# EAGLE design ledecorator-core-board (EAGLE 9.4.2)
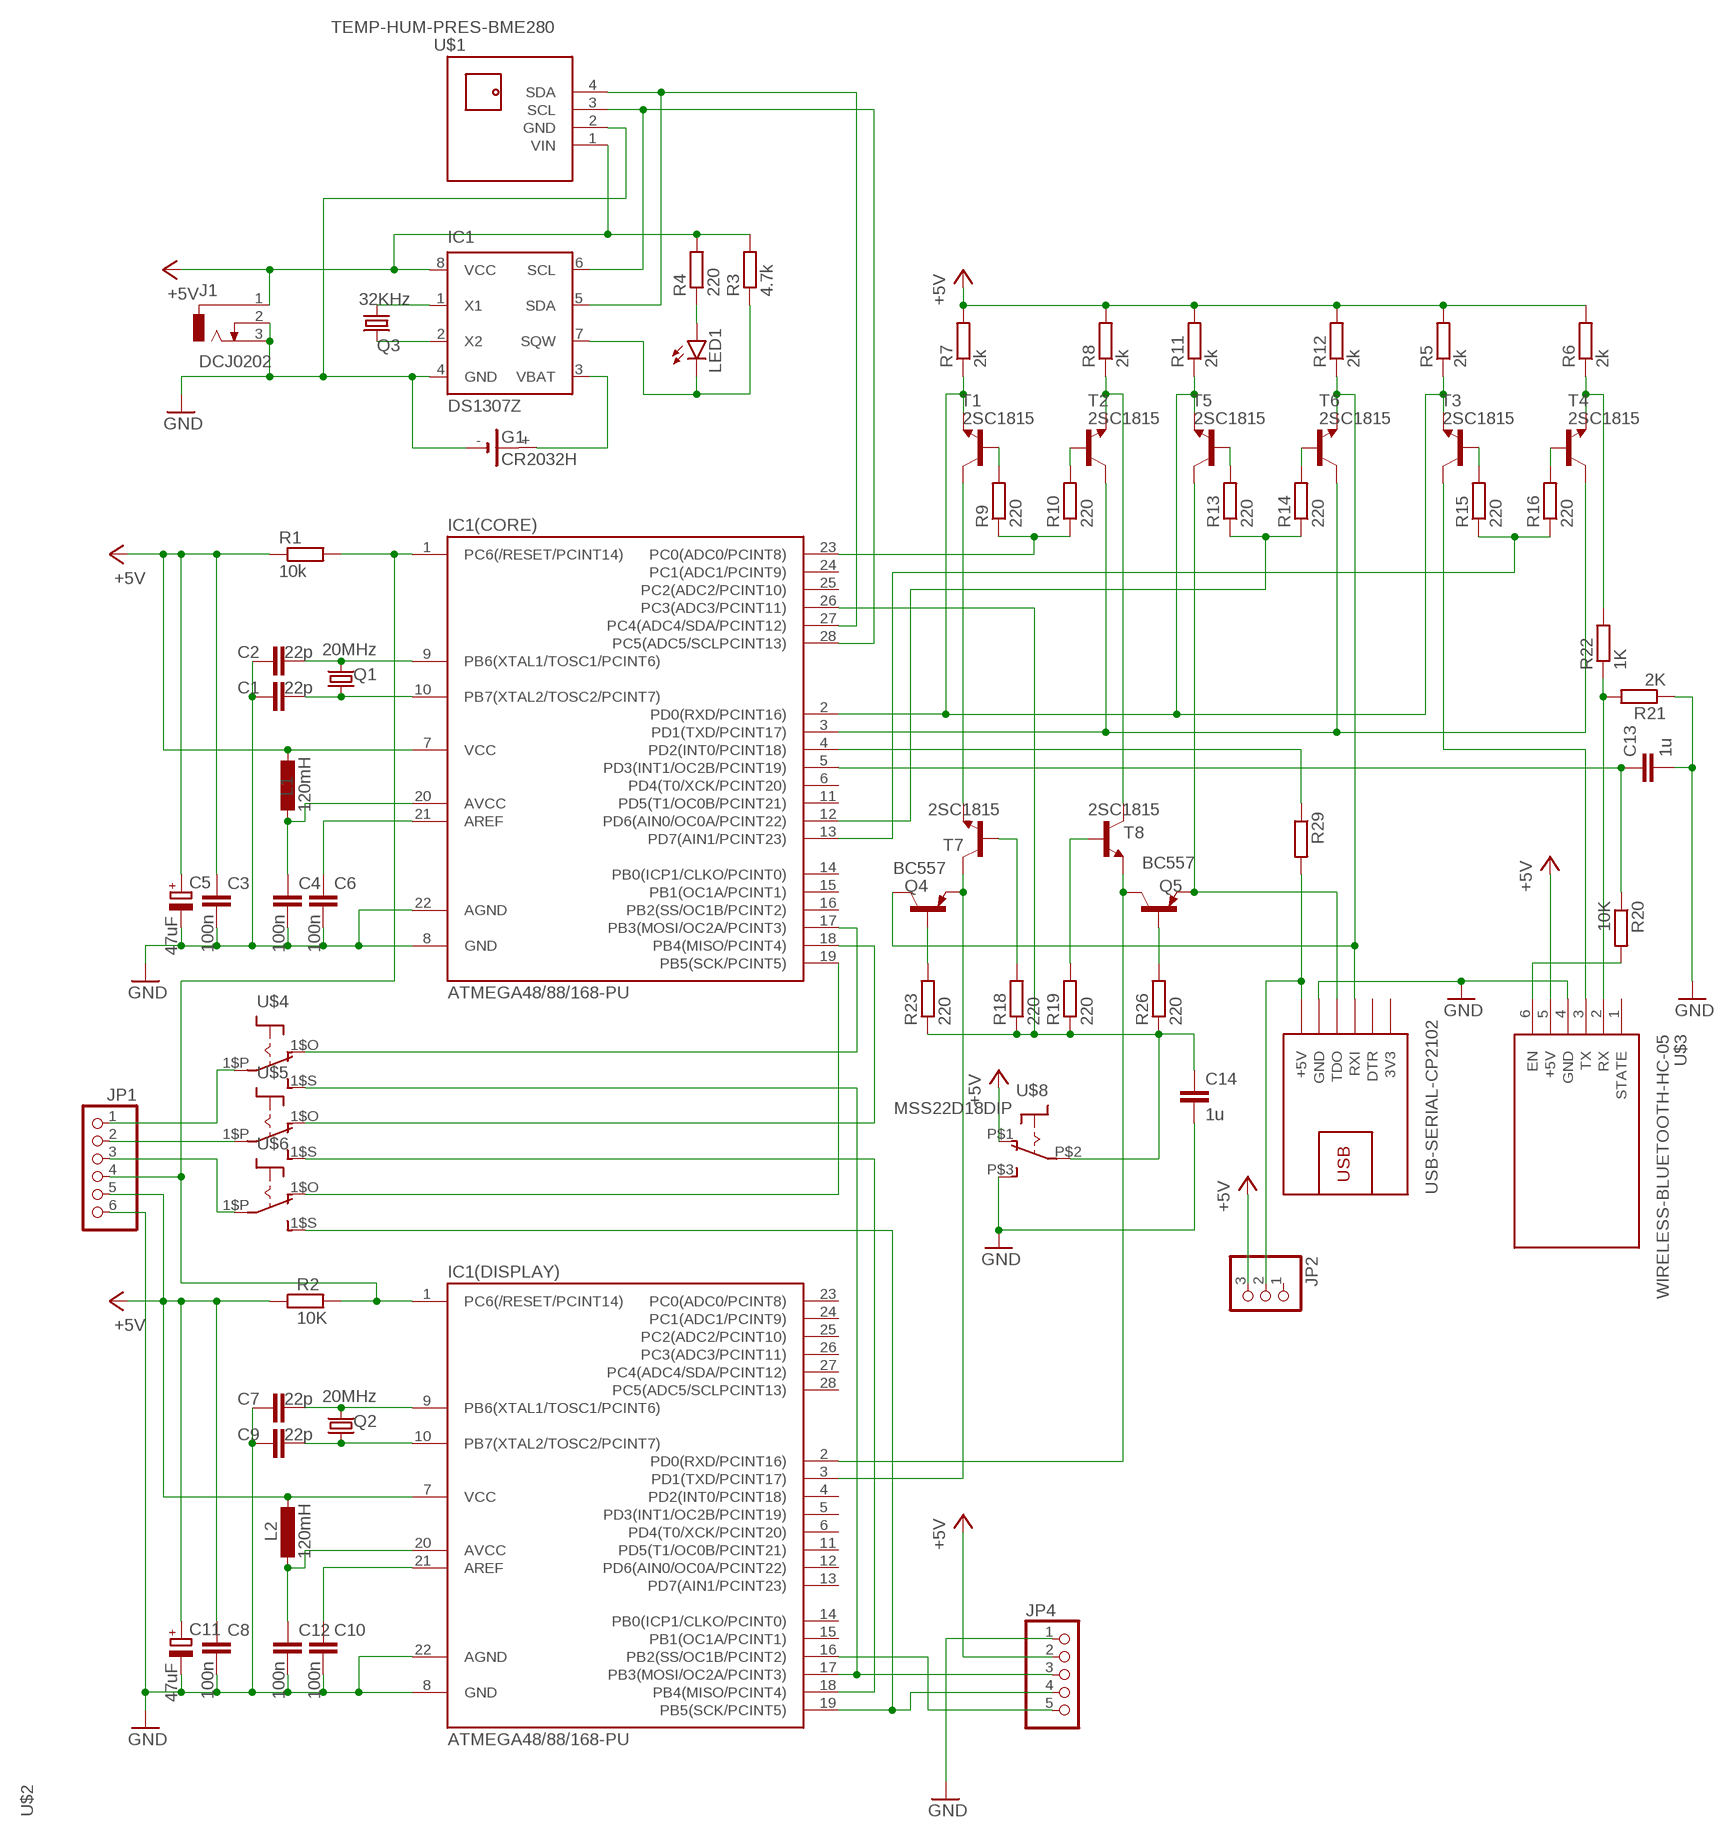
[diagram p0: schematic, sheet 1]

## Parts
C1  22p  C-EU025-025X050  [C025-025X050]
C2  22p  C-EU025-025X050  [C025-025X050]
C3  100n  C-EU025-025X050  [C025-025X050]
C4  100n  C-EUC1206  [C1206]
C5  47uF  CPOL-EUE2-4  [E2-4]
C6  100n  C-EUC1206  [C1206]
C7  22p  C-EU025-025X050  [C025-025X050]
C8  100n  C-EU025-025X050  [C025-025X050]
C9  22p  C-EU025-025X050  [C025-025X050]
C10  100n  C-EU025-025X050  [C025-025X050]
C11  47uF  CPOL-EUE2-4  [E2-4]
C12  100n  C-EU025-025X050  [C025-025X050]
C13  1u  C-EUC1206  [C1206]
C14  1u  C-EU050-025X075  [C050-025X075]
G1  CR2032H  [CR2032H]
IC1  DS1307Z  [SOIC8]
IC1(CORE)  ATMEGA48/88/168-PU  [DIL28-3]
IC1(DISPLAY)  ATMEGA48/88/168-PU  [DIL28-3]
J1  DCJ0202  [DCJ0202]
JP1  PINHD-1X6/90  [1X06/90]
JP2  PINHD-1X3/90  [1X03/90]
JP4  PINHD-1X5  [1X05]
L1  120mH  L-EU0207/10  [0207/10]
L2  120mH  L-EU0207/10  [0207/10]
LED1  LED3MM  [LED3MM]
Q1  20MHz  CRYSTALHC49S  [HC49/S]
Q2  20MHz  CRYSTALHC49S  [HC49/S]
Q3  32KHz  CRYSTALTC26H  [TC26H]
Q4  BC557  [TO92-EBC]
Q5  BC557  [TO92-EBC]
R1  10k  R-EU_0207/10  [0207/10]
R2  10K  R-EU_0207/10  [0207/10]
R3  4.7k  R-EU_R1206  [R1206]
R4  220  R-EU_R1206  [R1206]
R5  2k  R-EU_0207/12  [0207/12]
R6  2k  R-EU_0207/12  [0207/12]
R7  2k  R-EU_R1206  [R1206]
R8  2k  R-EU_R1206  [R1206]
R9  220  R-EU_0207/10  [0207/10]
R10  220  R-EU_0207/10  [0207/10]
R11  2k  R-EU_0207/12  [0207/12]
R12  2k  R-EU_0207/10  [0207/10]
R13  220  R-EU_0207/10  [0207/10]
R14  220  R-EU_0207/10  [0207/10]
R15  220  R-EU_0207/10  [0207/10]
R16  220  R-EU_0207/10  [0207/10]
R18  220  R-EU_0207/10  [0207/10]
R19  220  R-EU_0207/10  [0207/10]
R20  10K  R-EU_0207/10  [0207/10]
R21  2K  R-EU_0207/10  [0207/10]
R22  1K  R-EU_0207/10  [0207/10]
R23  220  R-EU_R1206  [R1206]
R26  220  R-EU_R1206  [R1206]
R29  R-EU_0207/10  [0207/10]
T1  2SC1815  [TO92-ECB]
T2  2SC1815  [TO92-ECB]
T3  2SC1815  [TO92-ECB]
T4  2SC1815  [TO92-ECB]
T5  2SC1815  [TO92-ECB]
T6  2SC1815  [TO92-ECB]
T7  2SC1815  [TO92-ECB]
T8  2SC1815  [TO92-ECB]
U$1  TEMP-HUM-PRES-BME280  [TEMP-HUM-PRES-BME280]
U$2  USB-SERIAL-CP2102  [USB-SERIAL-CP2102]
U$3  WIRELESS-BLUETOOTH-HC-05  [WIRELESS-BLUETOOTH-HC-05]
U$4  SS12D00DIP  [SS12D00]
U$5  SS12D00DIP  [SS12D00]
U$6  SS12D00DIP  [SS12D00]
U$8  MSS22D18DIP  [MSS22D18]

## Nets
+5V: C3.1 C5.+ C8.1 C11.+ IC1(CORE).7(VCC) IC1(DISPLAY).7(VCC) IC1.8(VCC) J1.1 JP1.5 JP2.3 JP4.2 L1.1 L2.1 R1.1 R2.1 R3.2 R4.2 R5.2 R6.2 R7.2 R8.2 R11.2 R12.2 U$1.1(VIN) U$3.5(+5V) U$8.P$1(O)
BLE$CTRL: IC1(CORE).13(PD7(AIN1/PCINT23)) R15.1 R16.1
BLE$RX: R21.2 R22.1 U$3.2(RX)
BLE$TX: T3.C U$3.3(TX)
BLR$STATE$1: C13.1 IC1(CORE).5(PD3(INT1/OC2B/PCINT19)) R20.1
DISPLAY$RX: IC1(DISPLAY).2(PD0(RXD/PCINT16)) Q5.C T8.E
DISPLAY$SRC: C14.1 IC1(CORE).26(PC3(ADC3/PCINT11)) R18.1 R19.1 R23.1 R26.1 U$8.P$2(P)
DISPLAY$TX: IC1(DISPLAY).3(PD1(TXD/PCINT17)) Q4.E T7.C
GND: C1.1 C2.1 C3.2 C4.2 C5.- C6.2 C7.1 C8.2 C9.1 C10.2 C11.- C12.2 C13.2 C14.2 G1.- IC1(CORE).8(GND) IC1(CORE).22(AGND) IC1(DISPLAY).8(GND) IC1(DISPLAY).22(AGND) IC1.4(GND) J1.2 J1.3 JP1.6 JP4.1 R21.1 U$1.2(GND) U$2.5(GND) U$3.4(GND) U$8.P$3(S)
MISO: JP1.2 U$5.1$P(P)
MOSI: JP1.1 U$4.1$P(P)
N$1: C6.1 IC1(CORE).21(AREF)
N$2: Q4.B R23.2
N$3: C2.2 IC1(CORE).9(PB6(XTAL1/TOSC1/PCINT6)) Q1.2
N$4: C1.2 IC1(CORE).10(PB7(XTAL2/TOSC2/PCINT7)) Q1.1
N$5: IC1.2(X2) Q3.2
N$6: C4.1 IC1(CORE).20(AVCC) L1.2
N$7: C7.2 IC1(DISPLAY).9(PB6(XTAL1/TOSC1/PCINT6)) Q2.2
N$8: C9.2 IC1(DISPLAY).10(PB7(XTAL2/TOSC2/PCINT7)) Q2.1
N$9: C10.1 IC1(DISPLAY).21(AREF)
N$10: C12.1 IC1(DISPLAY).20(AVCC) L2.2
N$11: LED1.A R4.1
N$12: G1.+ IC1.3(VBAT)
N$13: IC1.1(X1) Q3.1
N$14: IC1.7(SQW) LED1.K(C) R3.1
N$16: R10.2 T2.B
N$17: R9.2 T1.B
N$18: IC1(CORE).23(PC0(ADC0/PCINT8)) R9.1 R10.1
N$19: R15.2 T3.B
N$20: R16.2 T4.B
N$21: R20.2 U$3.6(EN)
N$22: R13.2 T5.B
N$23: R14.2 T6.B
N$25: R18.2 T7.B
N$26: R19.2 T8.B
N$28: R6.1 R22.2 T4.E
N$29: IC1(DISPLAY).16(PB2(SS/OC1B/PCINT2)) JP4.5
N$30: T1.C T7.E
N$37: R8.1 T2.E T8.C
N$42: IC1(CORE).18(PB4(MISO/PCINT4)) U$5.1$O(O)
N$43: IC1(CORE).17(PB3(MOSI/OC2A/PCINT3)) U$4.1$O(O)
N$45: Q5.B R26.2
N$49: JP2.2 R29.2 U$2.6(+5V)
N$50: IC1(DISPLAY).18(PB4(MISO/PCINT4)) U$5.1$S(S)
N$51: IC1(DISPLAY).17(PB3(MOSI/OC2A/PCINT3)) JP4.3 U$4.1$S(S)
RESET: IC1(CORE).1(PC6(/RESET/PCINT14)) IC1(DISPLAY).1(PC6(/RESET/PCINT14)) JP1.4 R1.2 R2.2
RX: IC1(CORE).2(PD0(RXD/PCINT16)) R5.1 R7.1 R11.1 T1.E T3.E T5.E
SCK: JP1.3 U$6.1$P(P)
SCK$CORE: IC1(CORE).19(PB5(SCK/PCINT5)) U$6.1$O(O)
SCK$DISPLAY: IC1(DISPLAY).19(PB5(SCK/PCINT5)) JP4.4 U$6.1$S(S)
SCL: IC1(CORE).28(PC5(ADC5/SCLPCINT13)) IC1.6(SCL) U$1.3(SCL)
SDA: IC1(CORE).27(PC4(ADC4/SDA/PCINT12)) IC1.5(SDA) U$1.4(SDA)
TX: IC1(CORE).3(PD1(TXD/PCINT17)) T2.C T4.C T6.C
USB$CTRL: IC1(CORE).12(PD6(AIN0/OC0A/PCINT22)) R13.1 R14.1
USB$RX: Q4.C R12.1 T6.E U$2.3(RXI)
USB$STATE: IC1(CORE).4(PD2(INT0/PCINT18)) R29.1
USB$TX: Q5.E T5.C U$2.4(TDO)
Unconnected: IC1(CORE).6(PD4(T0/XCK/PCINT20)) IC1(CORE).11(PD5(T1/OC0B/PCINT21)) IC1(CORE).14(PB0(ICP1/CLKO/PCINT0)) IC1(CORE).15(PB1(OC1A/PCINT1)) IC1(CORE).16(PB2(SS/OC1B/PCINT2)) IC1(CORE).24(PC1(ADC1/PCINT9)) IC1(CORE).25(PC2(ADC2/PCINT10)) IC1(DISPLAY).4(PD2(INT0/PCINT18)) IC1(DISPLAY).5(PD3(INT1/OC2B/PCINT19)) IC1(DISPLAY).6(PD4(T0/XCK/PCINT20)) IC1(DISPLAY).11(PD5(T1/OC0B/PCINT21)) IC1(DISPLAY).12(PD6(AIN0/OC0A/PCINT22)) IC1(DISPLAY).13(PD7(AIN1/PCINT23)) IC1(DISPLAY).14(PB0(ICP1/CLKO/PCINT0)) IC1(DISPLAY).15(PB1(OC1A/PCINT1)) IC1(DISPLAY).23(PC0(ADC0/PCINT8)) IC1(DISPLAY).24(PC1(ADC1/PCINT9)) IC1(DISPLAY).25(PC2(ADC2/PCINT10)) IC1(DISPLAY).26(PC3(ADC3/PCINT11)) IC1(DISPLAY).27(PC4(ADC4/SDA/PCINT12)) IC1(DISPLAY).28(PC5(ADC5/SCLPCINT13)) JP2.1 U$2.2(DTR) U$3.1(STATE)

## Power pins joined to a net without a drawn wire
3V3: U$2.1(3V3)

## Library data of the parts
C1-C4 C6-C10 C12-C14 = rcl:C-EU: CAPACITOR, European symbol; SPICEPREFIX: C
C5 C11 = rcl:CPOL-EU: POLARIZED CAPACITOR, European symbol; SPICEPREFIX: C
G1 = battery_cr2032:CR2032H: LI BATTERY Varta
IC1 = ds1307_pcf8583:DS1307: I2C-Bus CLOCK/CALENDAR
IC1(CORE) IC1(DISPLAY) = atmega8:ATMEGA48/88/168-PU
J1 = con-jack:DCJ0202: DC POWER JACK Source: DCJ0202.pdf; OC_FARNELL: unknown; OC_NEWARK: unknown
JP1 = pinhead:PINHD-1X6: PIN HEADER
JP2 = pinhead:PINHD-1X3: PIN HEADER
JP4 = pinhead:PINHD-1X5: PIN HEADER
L1 L2 = rcl:L-EU: INDUCTOR, European symbol; SPICEPREFIX: L
LED1 = led:LED: LED OSRAM: - CHIPLED LG R971, LG N971, LY N971, LG Q971, LY Q971, LO R971, LY R971 LH N974, LH R974 LS Q976, LO Q976, LY Q976 LO Q996 - Hyper CHIPLED LW Q18S LB Q993, LB Q99A, LB R99A - SideLED LS A670, LO A670, LY A670, LG A670, LP A670 LB A673, LV A673, LT A673, LW A673 LH A674 LY A675 LS A676, LA A676, LO A676, LY A676, LW A676 LS A679, LY A679, LG A679 - Hyper Micro SIDELED® LS Y876, LA Y876, LO Y876, LY Y876 LT Y87S - SmartLED LW L88C, LW L88S LB L89C, LB L89S, LG L890 LS L89K, LO L89K, LY L89K LS L896, LA L896, LO L896, LY L896 - TOPLED LS T670, LO T670, LY T670, LG T670, LP T670 LSG T670, LSP T670, LSY T670, LOP T670, LYG T670 LG T671, LOG T671, LSG T671 LB T673, LV T673, LT T673, LW T673 LH T674 LS T676, LA T676, LO T676, LY T676, LB T676, LH T676, LSB T676, LW T676 LB T67C, LV T67C, LT T67C, LS T67K, LO T67K, LY T67K, LW E67C LS E67B, LA E67B, LO E67B, LY E67B, LB E67C, LV E67C, LT E67C LW T67C LS T679, LY T679, LG T679 LS T770, LO T770, LY T770, LG T770, LP T770 LB T773, LV T773, LT T773, LW T773 LH T774 LS E675, LA E675, LY E675, LS T675 LS T776, LA T776, LO T776, LY T776, LB T776 LHGB T686 LT T68C, LB T68C - Hyper Mini TOPLED® LB M676 - Mini TOPLED Santana® LG M470 LS M47K, LO M47K, LY M47K Source: http://www.osram.convergy.de LUXEON: - LUMILED® LXK2-PW12-R00, LXK2-PW12-S00, LXK2-PW14-U00, LXK2-PW14-V00 LXK2-PM12-R00, LXK2-PM12-S00, LXK2-PM14-U00 LXK2-PE12-Q00, LXK2-PE12-R00, LXK2-PE12-S00, LXK2-PE14-T00, LXK2-PE14-U00 LXK2-PB12-K00, LXK2-PB12-L00, LXK2-PB12-M00, LXK2-PB14-N00, LXK2-PB14-P00, LXK2-PB14-Q00 LXK2-PR12-L00, LXK2-PR12-M00, LXK2-PR14-Q00, LXK2-PR14-R00 LXK2-PD12-Q00, LXK2-PD12-R00, LXK2-PD12-S00 LXK2-PH12-R00, LXK2-PH12-S00 LXK2-PL12-P00, LXK2-PL12-Q00, LXK2-PL12-R00 Source: www.luxeon.com KINGBRIGHT: KA-3528ASYC Source: www.kingbright.com
Q1 Q2 = crystal:CRYSTAL: CRYSTAL; OC_FARNELL: 1667008; OC_NEWARK: unknown
Q3 = crystal:CRYSTAL: CRYSTAL; OC_FARNELL: unknown; OC_NEWARK: unknown
Q4 Q5 = transistor-pnp:BC557*: PNP Transistror
R1-R16 R18-R23 R26 R29 = rcl:R-EU_: RESISTOR, European symbol; SPICEPREFIX: R
T1-T8 = transistor:2SC1815: NPN EPITAXIAL TRANSISTOR Source: TOSHIBA .. 2SC1815 1.pdf
U$1 = diy-modules:TEMP-HUM-PRES-BME280: Digital Humidity-Temperature-Pressure Sensor based on BME280 device More information about BME280 device is available here: https://www.bosch-sensortec.com/bst/products/all_products/bme280 Click here to find device on ebay.com <http://www.ebay.com/sch/bme280+breakout>
U$2 = diy-modules:USB-SERIAL-CP2102: USB to Serial UART Converter based on CP2102 chip More information about CP2102 chip is available here: https://www.silabs.com/documents/public/data-sheets/CP2102-9.pdf Drivers for CP210x devices are available here: http://www.silabs.com/products/development-tools/software/usb-to-uart-bridge-vcp-drivers Click here to find device on ebay.com <http://www.ebay.com/sch/cp2102+micro+usb>
U$3 = diy-modules:WIRELESS-BLUETOOTH-HC-05: Bluetooth Transceiver Module based on HC-05 board Tutorial is available here: https://arduino-info.wikispaces.com/BlueTooth-HC05-HC06-Modules-How-To Click here to find device on ebay.com <http://www.ebay.com/sch/hc-05+module+rs232>
U$4-U$6 = dragberry:SS12D00
U$8 = dragberry:MSS22D18

## Board
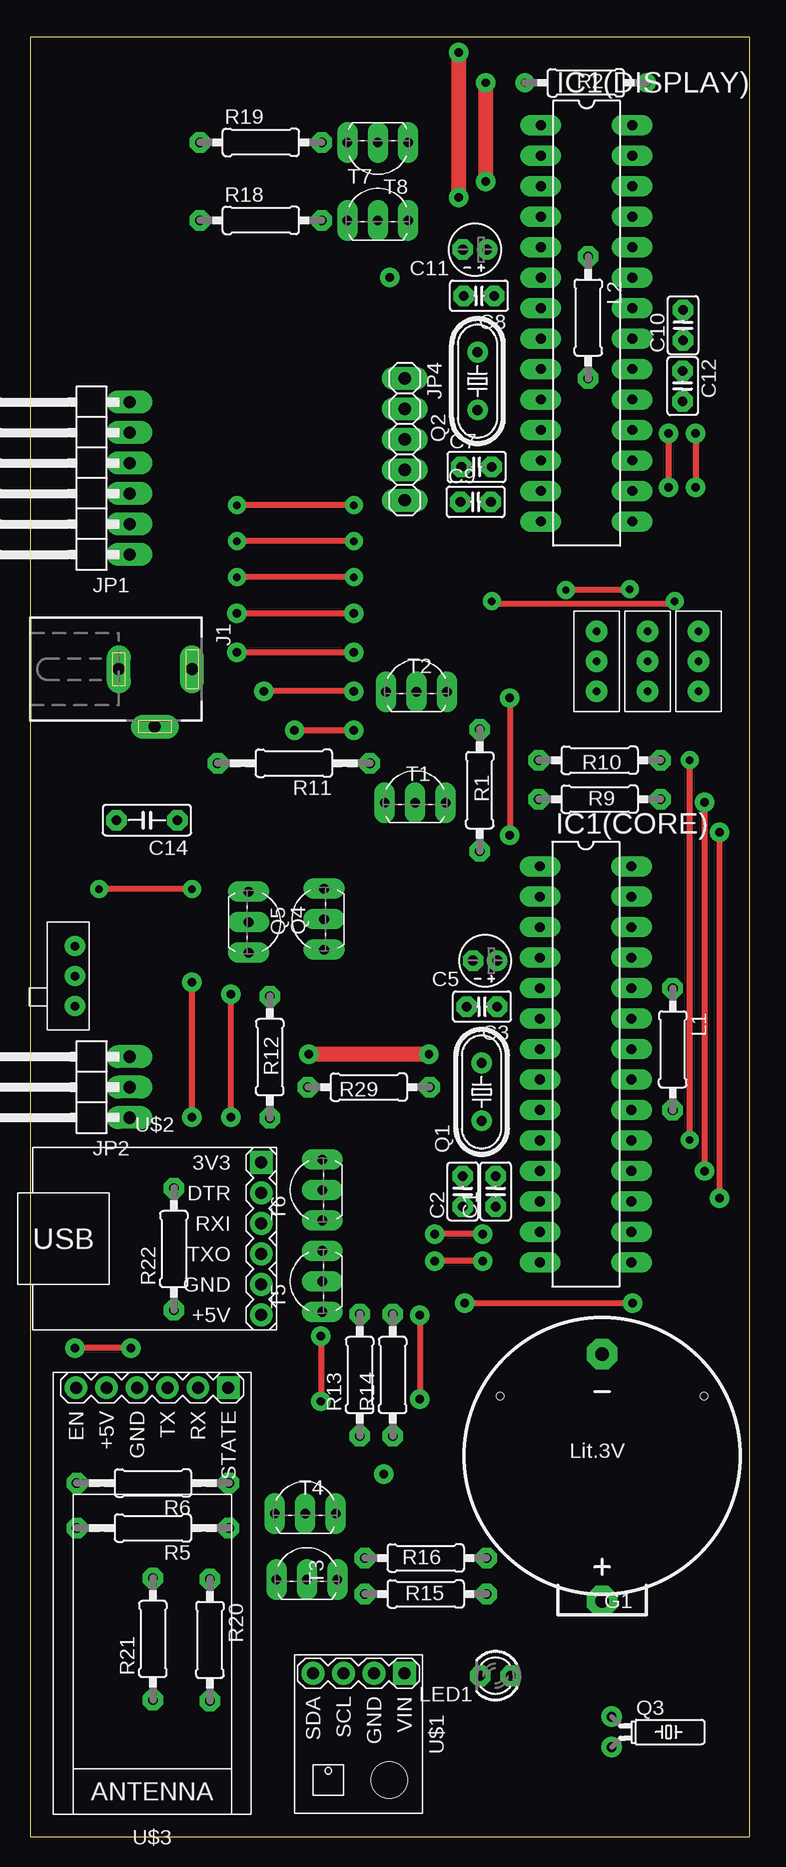
[diagram p1: board, top side]
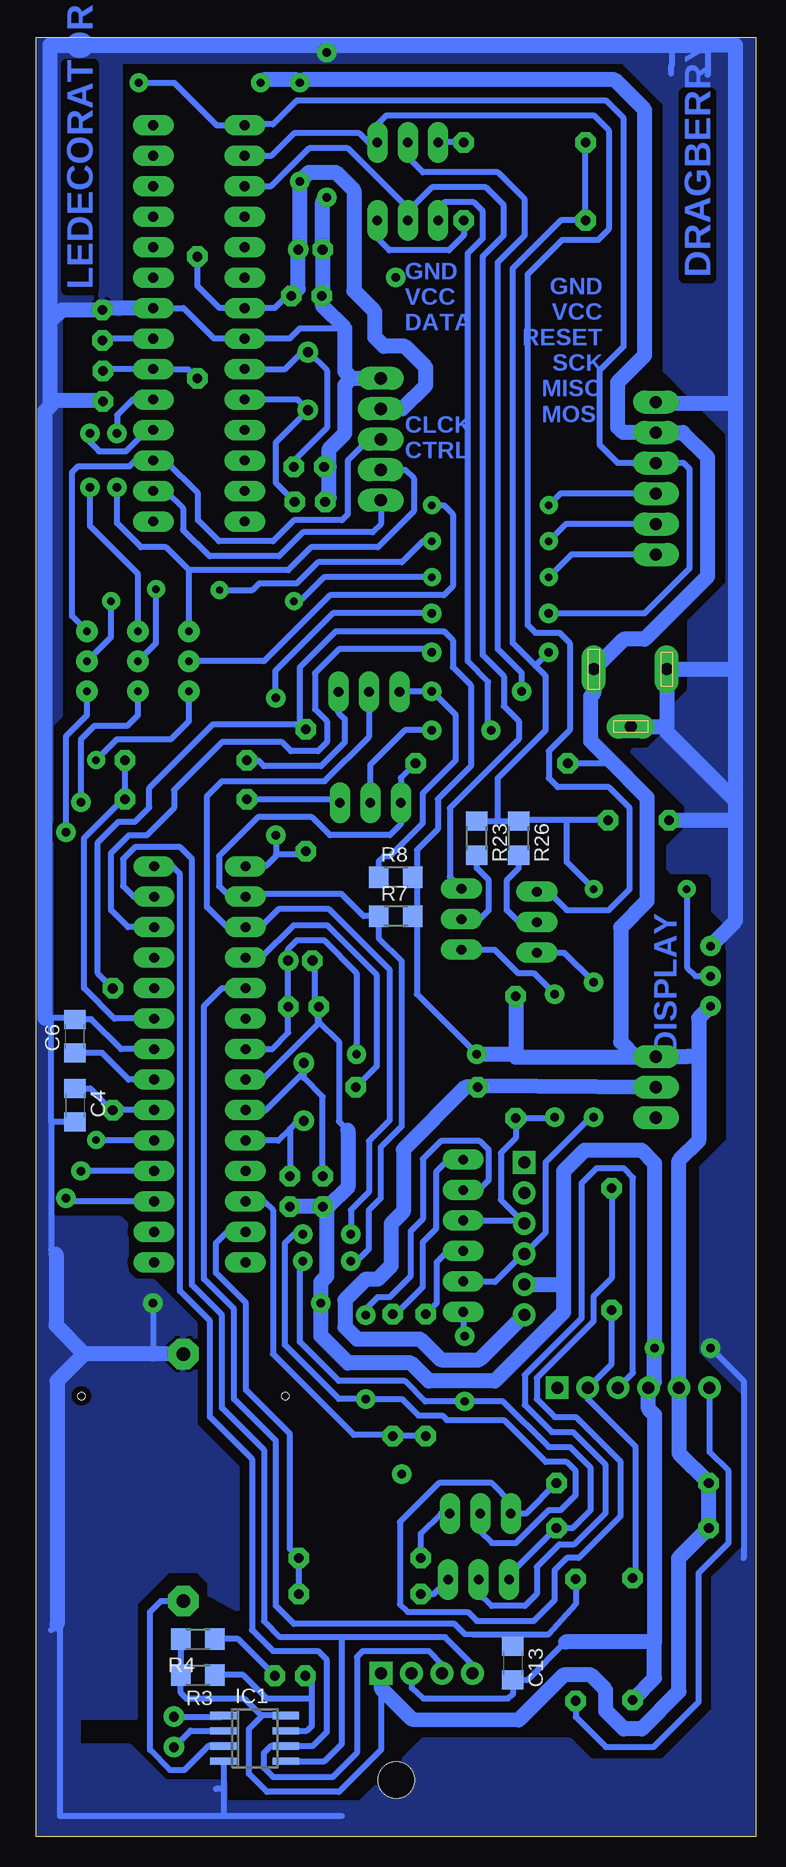
[diagram p2: board, bottom side, seen from below]

Size 60 x 150 mm. Coordinates in mm from the lower left corner, seen from the top.
Outline: 60,150 0,150 0,0 60,0 60,150
Copper layers (1*16): Top 0.035mm / dielectric 1.5mm / Bottom 0.035mm
Design rules "default *": minimum track width 0.3mm, minimum drill 0.6mm, track to track 6mil, track to pad 6mil, pad to pad 6mil, via to via 6mil, smd to smd 6mil, copper to edge 0mil, drill to drill 6mil, minimum pad ring 0.45mm, minimum via ring 0.45mm, stop-mask expansion 4mil, vias tented up to drill 0mil, thermal gap 10mil

### Footprints (pad centres in the part's own frame; a part is rotated, then mirrored left to right if it is on the bottom)
C025-025X050 = drill 0.813 octagon: 1 -1.27,0; 2 1.27,0
C1206 = smd 1.6 x 1.8: 1 -1.4,0; 2 1.4,0
E2-4 = drill 0.813 pad 1.27: + -1.016,0 | drill 0.813 pad 1.27 octagon: - 1.016,0
C050-025X075 = drill 0.813 octagon: 1 -2.54,0; 2 2.54,0
CR2032H = drill 1.118 pad 2.54 octagon: + 0,12.1; - 0,-8.5 | hole 0.6: -8.5,-5; 8.5,-5
SOIC8 = smd 0.6 x 2.2: 1 -1.905,-2.6; 2 -0.635,-2.6; 3 0.635,-2.6; 4 1.905,-2.6; 5 1.905,2.6; 6 0.635,2.6; 7 -0.635,2.6; 8 -1.905,2.6
DIL28-3 = drill 0.813 long: 1 -16.51,-3.81; 2 -13.97,-3.81; 3 -11.43,-3.81; 4 -8.89,-3.81; 5 -6.35,-3.81; 6 -3.81,-3.81; 7 -1.27,-3.81; 8 1.27,-3.81; 9 3.81,-3.81; 10 6.35,-3.81; 11 8.89,-3.81; 12 11.43,-3.81; 13 13.97,-3.81; 14 16.51,-3.81; 15 16.51,3.81; 16 13.97,3.81; 17 11.43,3.81; 18 8.89,3.81; 19 6.35,3.81; 20 3.81,3.81; 21 1.27,3.81; 22 -1.27,3.81; 23 -3.81,3.81; 24 -6.35,3.81; 25 -8.89,3.81; 26 -11.43,3.81; 27 -13.97,3.81; 28 -16.51,3.81
DCJ0202 = drill 1 pad 2 long: 1 0,3.1; 2 4.8,0; 3 0,-3
1X06/90 = drill 1.016 long: 1 -6.35,-3.81; 2 -3.81,-3.81; 3 -1.27,-3.81; 4 1.27,-3.81; 5 3.81,-3.81; 6 6.35,-3.81
1X03/90 = drill 1.016 long: 1 -2.54,-3.81; 2 0,-3.81; 3 2.54,-3.81
1X05 = drill 1.016 long: 1 -5.08,0; 2 -2.54,0; 3 0,0; 4 2.54,0; 5 5.08,0
0207/10 = drill 0.813 octagon: 1 -5.08,0; 2 5.08,0
LED3MM = drill 0.813 octagon: A -1.27,0; K 1.27,0
HC49/S = drill 0.813: 1 -2.413,0; 2 2.413,0
TC26H = drill 0.813: 1 -1.27,0; 2 1.27,0
TO92-EBC = drill 0.813 long: B 0,-1.27; C -2.54,-1.27; E 2.54,-1.27
0207/10' = drill 0.65 pad 1.27: 1 -5.08,0; 2 5.08,0
R1206 = smd 1.6 x 1.803: 1 -1.422,0; 2 1.422,0
0207/12 = drill 0.813 octagon: 1 -6.35,0; 2 6.35,0
TO92-ECB = drill 0.813 long: B 2.54,0; C 0,0; E -2.54,0
TEMP-HUM-PRES-BME280 = drill 1 square: 1 -5.08,3.81 | drill 1: 2 -5.08,1.27; 3 -5.08,-1.27; 4 -5.08,-3.81 | hole 3: 3.81,2.54
USB-SERIAL-CP2102 = drill 1 square: 1 8.89,6.35 | drill 1: 2 8.89,3.81; 3 8.89,1.27; 4 8.89,-1.27; 5 8.89,-3.81; 6 8.89,-6.35
WIRELESS-BLUETOOTH-HC-05 = drill 1 square: 1 -6.35,-17.145 | drill 1: 2 -3.81,-17.145; 3 -1.27,-17.145; 4 1.27,-17.145; 5 3.81,-17.145; 6 6.35,-17.145
SS12D00 = drill 0.6 pad 1.778: 1$O -2.5,0; 1$P 0,0; 1$S 2.5,0
MSS22D18 = drill 0.7 pad 1.676: P$1 -2.5,0; P$2 0,0; P$3 2.5,0

### Placement (x,y rotation side)
C1  38.83,53.81 90 top
C2  36.09,53.81 90 top
C3  37.69,69.21 180 top
C4  56.75,61 270 bottom
C5  37.96,73.05 180 top
C6  56.75,66.75 90 bottom
C7  37.24,114.2 0 top
C8  37.44,128.46 180 top
C9  37.16,111.29 0 top
C10  54.46,126.01 90 top
C11  37.11,132.31 180 top
C12  54.42,120.94 270 top
C13  20.25,14.5 270 bottom
C14  9.75,84.75 180 top
G1  47.71,31.76 180 top
IC1  41.76,8.22 270 bottom
IC1(CORE)  46.34,64.4 270 top
IC1(DISPLAY)  46.41,126.17 270 top
J1  10.4,97.34 270 top
JP1  4.5,113.25 90 top
JP2  4.5,62.5 90 top
JP4  31.25,116.5 270 top
L1  53.6,65.65 270 top
L2  46.55,126.65 270 top
LED1  38.81,13.43 180 top
Q1  37.66,62.1 90 top
Q2  37.32,121.35 90 top
Q3  48.5,8.75 270 top
Q4  23.25,76.5 90 top
Q5  19.5,76.25 270 top
R1  37.5,87.25 270 top
R2  10K  [0207/10']  46.35,146.22 0 top
R3  46.5,13.5 180 bottom
R4  46.5,16.5 180 bottom
R5  10.25,25.75 180 top
R6  10.25,29.5 180 top
R7  30,76.75 0 bottom
R8  30,80 0 bottom
R9  47.5,86.5 180 top
R10  47.5,89.75 180 top
R11  22,89.5 180 top
R12  20,65 90 top
R13  27.5,38.5 90 top
R14  30.25,38.5 90 top
R15  33,20.25 180 top
R16  33,23.25 180 top
R18  19.25,134.75 0 top
R19  19.25,141.25 0 top
R20  15,16.42 270 top
R21  10.25,16.5 90 top
R22  12,49 90 top
R23  23.25,83.25 270 bottom
R26  19.75,83.25 270 bottom
R29  28.25,62.5 180 top
T1  32.12,86.2 0 top
T2  32.23,95.45 0 top
T3  23.09,21.45 0 top
T4  22.95,26.95 0 top
T5  24.37,46.31 90 top
T6  24.37,53.92 90 top
T7  29,134.75 0 top
T8  29,141.25 180 top
U$1  27.41,8.56 270 top
U$2  10.4,49.87 0 top
U$3  10.19,20.3 180 top
U$4  55.75,98 90 top
U$5  51.5,98 90 top
U$6  47.25,98 90 top
U$8  3.75,71.75 90 top

### Tracks (layer width: path | path; a pad name or v marks a point on that pad's centre or on a via)
+5V  (via drill 0.7 pad 1.3)
  Top 1.27: v23.25,65.25 v33.27,65.25 | v38,138 v38,146.22
  Bottom 0.508: L1.1 54.85,71.98 54.85,82.9 53.12,84.62 51.75,84.62 50.56,85.81 50.56,87.44 45.25,92.75 37.92,92.75 R1.1 38,92.83 38,97.5 35,100.5 26,100.5 25.25,99.75 25.25,97.5 23.75,96 23.75,89.25 26.5,86.5 26.5,84 28.25,82.25 28.25,79.67 | IC1(CORE).7 40.33,65.67 38.96,67.04 C3.1 38.96,73.03 C5.+ 38.98,74.02 38.25,74.75 36,74.75 33.27,72.02 v33.27,65.25 | v23.25,65.25 28.25,70.25 28.25,76.75 | 28.25,79.67 28.25,76.75 | L2.1 46.55,129.3 44.69,127.44 IC1(DISPLAY).7 40.1,127.44 39.08,128.46 C8.1 | R7.2 28.25,76.75 | R8.2 28.25,79.67 | 12.21,89.8 12.5,89.5 R11.2 | U$1.1 | 31.22,12.39 31.22,7.28 34.75,3.75 40.75,3.75 42.25,5.25 42.25,9 41.12,10.12 IC1.8 41.25,10.12 42.62,11.5 47.42,11.5 47.92,12 R3.2 R4.2
  Bottom 1.27: U$8.P$1 4.75,68.25 4.75,65.08 4.79,65.04 | U$1.1 31.22,12.39 28.66,9.82 19.75,9.75 16,13.5 13.75,13.5 12.5,12.25 12.5,10.5 11,9 9.5,9 6.38,12.12 6.38,23.25 6.4,23.25 R5.2 R6.2 6.38,31.98 U$3.5 6.38,56.37 4.75,58 4.75,65.04 4.79,65.04 | JP2.3 10.04,65.04 11.25,66.25 11.25,75.81 9.06,78 9.06,86.65 12.21,89.8 13.75,91.34 13.75,95.09 13.5,95.34 J1.1 11,99.84 9.25,99.84 4,105.09 4,115 6.06,117.06 JP1.5 11.06,117.06 11.5,117.5 11.5,121.25 9.25,123.5 9.25,143.97 11.75,146.47 37.75,146.47 v38,146.22 38.25,146.47 41.02,146.47 R2.1 | JP2.3 5.75,65.04 4.79,65.04 | C8.1 38.13,129.04 C11.+ 38,132.44 v38,138 37.25,138.75 35,138.75 33.5,137.25 33.5,128.88 31.75,127.12 31.75,125 31,124.25 29.25,124.25 27.5,122.5 27.5,121 29.46,119.04 JP4.2 | v23.25,65.25 20,65.25 | JP2.3 8.35,65 20,65 20,65.25 | R12.2 20,65.25
BLE$CTRL
  Bottom 0.508: R15.1 R16.1 38.83,24 38.83,33.58 42.5,37.25 42.5,44.5 45,47 45,49.5 44.07,50.43 IC1(CORE).13
BLE$RX
  Bottom 0.508: U$3.2 12,39.45 R22.1 | U$3.2 14,36.95 | R21.2 10,21.83 10,32.5 14,36.5 U$3.2
BLE$TX
  Bottom 0.508: U$3.3 10.21,38.7 10.21,54.96 11,55.75 13.25,55.75 14.5,54.5 14.5,43.25 19.25,38.5 19.25,36 17,33.75 15.25,33.75 12.5,31 12.5,27 15.09,24.41 16.34,24.41 18.25,22.5 18.25,20.25 19.25,19.25 22,19.25 23.09,20.34 T3.C
BLR$STATE$1
  Bottom 0.508: R20.1 15,19.4 17.28,16.85 20.25,16.85 | 20.25,16.85 23.58,16.85 24.25,16.9 25.1,17.75 38.5,17.75 40,19.25 40,33 43.5,36.5 43.5,44 46,46.5 46,69.25 44.5,70.75 IC1(CORE).5 | C13.1 20.25,16.85
DISPLAY$RX
  Bottom 0.508: Q5.C 17.29,78.79 15.75,77.25 12.25,77.25 10.5,79 10.5,85.75 12.25,87.5 16.5,87.5 17.25,88.25 17.25,90.5 15.5,92.25 15.5,99.5 16.38,100.38 18.38,100.38 19,101 19,130.25 16.12,133.12 13.12,133.12 12.25,134 12.25,142.25 13.5,143.5 30.79,143.5 31.54,142.75 T8.E 32.29,141.25 33.04,142 38.5,142 40.36,140.14 IC1(DISPLAY).2
DISPLAY$SRC  (via drill 0.6, 0.7 pad 1.3)
  Top 0.508: v17.25,98.75 v27,98.75 | v13.5,79 v5.75,79
  Bottom 0.508: IC1(CORE).26 52.33,75.83 53.75,77.25 53.75,82 52.25,83.5 50.75,83.5 48.5,85.75 48.5,87.25 44.5,91.25 39.5,91.25 38.75,90.5 36.5,90.5 35.75,91.25 35.75,93 36.75,94 36.75,97 34.75,99 27.25,99 v27,98.75 | 15.75,84.75 15.75,81.25 v13.5,79 | C14.1 15.75,84.75 | v17.25,98.75 18.38,97.62 | R23.1 21.5,84.67 | 21.5,84.67 R26.1 19.67,84.75 15.75,84.75 | R19.1 R18.1 16.25,134.75 20.25,130.75 20.25,99.5 18.38,97.62 | 18.38,97.62 17.5,96.75 17.5,92.25 21.5,88.25 21.5,84.67 | U$8.P$2 5,71.75 5.67,72.42 5.67,78.5 5.75,78.58 v5.75,79
DISPLAY$TX
  Bottom 0.508: Q4.E 25.5,80.02 25.5,85.75 19.75,91.5 19.75,93 21,94.25 21,96.75 22.75,98.5 22.75,131.75 21,133.5 21,136 22.5,137.5 27,137.5 28.88,135.62 | T7.C 29,135.5 28.88,135.62 | 28.88,135.62 34,140.75 37.25,140.75 40.4,137.6 IC1(DISPLAY).3
GND  (via drill 0.7 pad 1.3)
  Top 0.508: v8.42,40.75 v3.75,40.75 | v36.25,44.5 v50.25,44.5
  Top 1.27: v35.75,136.65 v35.75,148.75
  Bottom 0.508: IC1(CORE).22 52.9,65.67 55.38,68.15 C6.2 56.85,68.25 58.73,68.25 | 58.33,48.57 58.73,48.97 58.73,59.6 | C4.2 58.73,59.6 | C5.- 36.73,72.84 36.73,69.52 36.48,69.27 | 36.48,69.27 C3.2 36.42,67.96 34.75,66.29 34.75,59.64 34,58.89 | IC1(CORE).8 41.12,63.13 36.48,67.77 36.48,69.27 | IC1(DISPLAY).8 38.85,124.9 38,125.75 34.25,125.75 34,125.75 | IC1(DISPLAY).22 47.69,127.44 45.15,124.9 IC1(DISPLAY).8 | 42.6,125.07 IC1(DISPLAY).8 | 58.73,17.23 58.23,17.73 58,17.5 58,1.75 44.5,1.75 | 4,149.35 4,146.85 | 7,149.35 7,147.66 7.05,147.6 7.05,147 | v50.25,44.5 50.25,40.26 | U$1.2 28.68,12.43 27.71,11.54 20.64,11.54 20.25,11.85 C13.2 19,13.1 15.85,16.25 | v3.75,40.75 1,38 1,23.25 | 58.73,68.25 59.23,68.25 | 44.5,1.75 34.5,1.75 | 58.73,59.6 58.73,68.25 | IC1.4 44.36,4 | 44.36,4 44.36,1.89 44.5,1.75 | 44.36,4 45,4
  Bottom 1.27: U$2.5 16,46.06 | 16,46.06 16,43.75 21.75,38 27.25,38 28.75,39.5 34,39.5 36.25,41.75 v36.25,44.5 36.25,46.25 35.75,46.75 35.75,52.2 C2.1 | 16,46.06 16,55.5 14.25,57.25 9.5,57.25 8.42,56.17 v8.42,40.75 8.42,37.95 U$3.4 8.92,35.7 8.42,35.2 8.42,16.25 | 8.42,16.25 8.42,13.25 R21.1 | 1.65,84.75 1.65,76.35 U$8.P$3 | 1.65,86.34 7.4,92.09 7.4,92.75 | 7.4,92.75 J1.3 1.75,97.34 | 55.96,40.26 55.97,40.26 58.23,38 58.23,17.73 | 34,58.89 34,54.13 35.59,52.54 C2.1 | G1.- 50.25,40.26 55.96,40.26 | 55.96,40.26 58.33,42.63 58.33,48.57 | 35.75,149.35 58.85,149.35 58.85,126.25 | 35.75,149.35 7,149.35 4,149.35 1.65,149.35 1.65,119.5 | 36.09,128.54 C11.- 36.09,136.31 v35.75,136.65 | 36.09,128.54 C8.2 | C12.2 54.5,119.75 58.35,119.75 58.73,119.37 | 58.85,126.25 57.82,127.28 C10.2 54.3,127.44 IC1(DISPLAY).22 | C14.2 1.65,84.75 | 35.55,114.2 C7.1 | C9.1 35.55,111.63 35.55,114.2 | 35.55,114.2 35.55,115.7 34.25,117 34.25,121 33.67,121.58 | J1.2 7.61,92.54 7.4,92.75 | C2.1 C1.1 | v35.75,148.75 35.75,149.35 | 33.67,121.58 JP4.1 | 33.67,121.58 34.25,122.16 34.25,125.75 36.09,127.59 36.09,128.54 | 1.65,84.75 1.65,86.34 | 1.65,86.34 1.65,119.5 | 58.73,119.37 59.23,118.87 59.23,68.25 | 58.85,126.25 58.85,119.49 58.73,119.37 | JP1.6 8.21,119.5 1.65,119.5 | 8.42,16.25 15.85,16.25
  pour Bottom (isolate 0.5): 59.75,149.75 59.75,127 53,127 53,149.75
  pour Bottom: 53,149.75 0.25,149.75 0.25,74 2.25,74 2.25,148 53,148
  pour Bottom (isolate 0.5): 59.75,126.75 59.75,0.25 56.5,0.25 56.5,10 51.75,10 51.75,19.5 49,22.25 46.5,22.25 45.5,21.25 45.5,20.25 43.25,19 43.25,30.75 46.75,34.25 46.75,42.75 50.25,46.25 51.75,46.25 52.5,47 52.5,51 53,51.5 58.75,51.5 58.75,92.75 58,93.5 58,126.75
  pour Bottom: 58.5,0.25 0.25,0.25 0.25,73.75 2.25,73.75 2.25,58 4.5,55.75 4.5,40.5 0.75,36.75 0.75,13.25 7.75,6.25 13.75,6.25 15.5,8 27.75,8 33,2.75 52.5,2.75 58.5,8.75
  pour Bottom (isolate 0.5): 2.25,117 7.5,122.25 7.5,144.5 12.75,149.75 2.25,149.75
  pour Bottom: 2.25,104.5 5.5,101.25 5.5,95.5 7.75,93.25 7.75,91.75 9,90.5 10.25,90.5 5.75,86 5.75,84 7.25,82.5 7.25,80.75 7,80.5 4,80.5 3.5,80 3.5,77.25 2.5,76.25 2.25,76.5
  pour Bottom: 3.5,10.75 0.25,14 0.25,24.75 3.5,21.5
  pour Bottom: 44.25,4.5 49.25,4.5 52.25,7.5 57,7.5 52.5,3 44.25,3
MISO  (via drill 0.6)
  Top 0.508: v27,108 v17.25,108 | v50,104 49.93,103.93 v44.68,103.93
  Bottom 0.508: JP1.2 15.81,109.44 v17.25,108 | v27,108 27.75,108 29.5,106.25 36.5,106.25 38.25,104.5 41.37,104.5 41.93,103.93 v44.68,103.93 | U$5.1$P 50,99.5 v50,104
MOSI  (via drill 0.6)
  Top 0.508: v27,105 v17.25,105 | v53.75,103 53.5,102.75 38.75,102.75 v38.5,103
  Bottom 0.508: JP1.1 15.35,106.9 v17.25,105 | v27,105 36,105 38,103 v38.5,103 | U$4.1$P 53.75,100 v53.75,103
N$1
  Bottom 0.508: IC1(CORE).21 52.28,63.13 54.5,65.35 C6.1
N$2
  Bottom 0.508: Q4.B 23,76.5 22.25,77.25 22.25,79.75 23.25,80.75 R23.2
N$3
  Bottom 0.508: IC1(CORE).9 40.83,60.59 37.66,63.76 | C2.2 36.09,61.69 37.66,63.26 37.66,63.76 | 37.66,63.76 Q1.2
N$4
  Bottom 0.508: 38.41,59.44 37.91,59.44 Q1.1 38.16,59.69 38.41,59.44 | 38.83,59.02 39.8,58.05 IC1(CORE).10 | 38.41,59.44 38.83,59.02 | 38.83,59.02 C1.2
N$5
  Bottom 0.508: Q3.2 47.12,8.86 IC1.2
N$6
  Bottom 0.508: IC1(CORE).20 53.58,60.59 L1.2 53.67,60.57 55.5,62.4 C4.1
N$7
  Bottom 0.508: IC1(DISPLAY).9 39.22,122.36 37.82,123.76 Q2.2 37.26,123.76 35.75,122.25 35.75,117.46 38.51,114.7 C7.2
N$8
  Bottom 0.508: IC1(DISPLAY).10 38.2,119.82 Q2.1 40,116.26 40,112.86 C9.2
N$9
  Bottom 0.508: IC1(DISPLAY).21 54.3,124.9 C10.1
N$10
  Bottom 0.508: L2.2 47.3,122.32 50.18,122.32 IC1(DISPLAY).20 54.27,122.36 C12.1
N$11
  Bottom 0.508: LED1.A 43.15,16.5 R4.1
N$12
  Bottom 0.508: IC1.3 45.61,7.58 47.61,5.58 48.84,5.58 50.5,7.25 50.5,18.75 49.59,19.66 G1.+
N$13
  Bottom 0.508: Q3.1 44.47,10.02 IC1.1
N$14
  Bottom 0.508: IC1.7 37.4,8.86 37,9.25 37,11.5 | LED1.K 37,12.89 37,11.5 | R3.1 42.75,13.5 40.75,11.5 37,11.5
N$16
  Bottom 0.508: T2.B 34.77,93.7 34.27,93.2 34.27,91.23 36.25,89.25 41,89.25 41.5,89.75 R10.2
N$17
  Bottom 0.508: R9.2 34.96,86.5 T1.B
N$18
  Bottom 0.508: IC1(CORE).23 53.46,68.21 56,70.75 56,83.25 52.75,86.5 R9.1 R10.1
N$19
  Bottom 0.508: R15.2 26.83,20.25 T3.B
N$20
  Bottom 0.508: T4.B 26.24,26.95 27.92,25.27 R16.2
N$21
  Bottom 0.508: R20.2 15,10 12.5,7.5 8.5,7.5 4.75,11.25 4.75,22 2.25,24.5 2.25,30.5 3.84,32.09 U$3.6
N$22
  Bottom 0.508: T5.B 25.65,48.85 26.58,47.92 26.58,44.5 R13.2
N$23
  Bottom 0.508: R14.2 30,43.58 27.75,45.83 27.75,49.58 26.62,50.71 26.62,55.46 25.62,56.46 T6.B
N$24  (via drill 0.7 pad 1.3)
  other vias: 30,130
N$25
  Bottom 0.508: R18.2 24.33,133.5 25.58,132.25 30.54,132.25 31.54,133.25 T7.B
N$26
  Bottom 0.508: R19.2 T8.B
N$27  (via drill 0.7 pad 1.3)
  other vias: 29.5,30.25
N$28
  Bottom 0.508: R22.2 12,46.58 13.5,45.08 13.5,43 18.25,38.25 18.25,36.5 16.75,35 15,35 11.25,31.25 11.25,26.75 14.75,23.25 15.75,23.25 16.75,22.25 16.75,19.75 18.5,18 23.25,18 24,18.75 29,18.75 29.66,19.41 29.66,26.25 26.41,29.5 22,29.5 20.41,27.91 T4.E 19.15,26.95 R6.1
N$29
  Bottom 0.508: JP4.5 31.25,109.42 31.92,108.75 37.75,108.75 39.75,106.75 45.52,106.75 47.76,108.99 47.75,109 47.75,110.75 49.2,112.2 IC1(DISPLAY).16
N$30  (via drill 0.7 pad 1.3)
  Top 0.508: v22.06,92.25 v27,92.25
  Bottom 0.508: v27,92.25 29.25,92.25 32.12,89.38 T1.C | T7.E 26.46,135.75 25.96,136.25 23.5,136.25 22.75,135.5 22.75,133.25 24,132 24,98 22.31,96.31 22.31,92.5 v22.06,92.25
N$37  (via drill 0.7 pad 1.3)
  Top 0.508: v27,95.5 v19.5,95.5
  Bottom 0.508: T8.C 29,140 27.75,138.75 21.5,138.75 19.25,136.5 19.25,133.5 21.5,131.25 21.5,99 19.5,97 v19.5,95.5 | T2.E 29.64,95.5 v27,95.5 25,93.5 25,89.75 27.75,87 27.75,84.5 30.5,81.75 31,81.75 31.42,81.33 R8.1
N$42  (via drill 0.7 pad 1.3)
  Top 0.508: v56.25,55.51 v56.25,86.25
  Bottom 0.508: IC1(CORE).18 v56.25,55.51 | v56.25,86.25 56.25,91.5 55.12,92.62 52.38,92.62 51.5,93.5 U$5.1$O
N$43  (via drill 0.7 pad 1.3)
  Top 0.508: v57.5,53.25 v57.5,83.75
  Bottom 0.508: IC1(CORE).17 57.25,52.97 57.25,53 v57.5,53.25 | v57.5,83.75 57.5,91.75 55.75,93.5 U$4.1$O
N$45
  Bottom 0.508: Q5.B 19.75,76.25 20.75,77.25 20.75,79.75 19.75,80.75 R26.2
N$49
  Bottom 1.27: U$2.6 23.04,39.77 26.25,39.77 27.98,41.5 33.25,41.5 34.25,42.5 34.25,44.75 32.5,46.5 31.5,46.5 30.38,47.62 30.38,51.12 29.38,52.12 29.38,57.3 24.17,62.5 R29.2 23.09,62.58 JP2.2
N$50  (via drill 0.7 pad 1.3)
  Top 0.508: v55.5,117 v55.5,112.5
  Bottom 0.508: U$5.1$S 51.5,105.25 55.5,109.25 v55.5,112.5 | v55.5,117 55.5,116.25 54.75,115.5 52.5,115.5 50.72,117.28 IC1(DISPLAY).18
N$51
  Bottom 0.508: U$4.1$S 57,101.75 57,113.75 56.51,114.24 52.22,114.24 51.72,114.74 IC1(DISPLAY).17 49.24,114.74 46.5,112 46.5,109.75 44.75,108 40.25,108 38.5,109.75 34.5,109.75 34,110.25 34,114.75 32.25,116.5 JP4.3
RESET  (via drill 0.7 pad 1.3)
  Top 0.508: v40,94.94 v40,83.5 | v17.25,102 v27,102
  Bottom 0.508: IC1(CORE).1 42.58,80.96 | 42.58,80.96 42.71,80.96 42.71,80.91 | R2.2 48.47,146.22 44.93,142.68 IC1(DISPLAY).1 42.53,142.75 40.25,142.75 38.25,144.75 12.5,144.75 11,143.25 11,124.25 13,122.25 13,116.02 11.5,114.52 JP1.4 | R1.2 37.75,81.92 40,81.92 v40,83.5 40,81.75 40.79,80.96 42.58,80.96 | v17.25,102 9.25,102 5.5,105.75 5.5,114.02 6,114.52 JP1.4 | v40,94.94 40.06,95 40.06,97.19 35.25,102 v27,102 | JP1.4 10.23,114.52 10.25,114.5
RX  (via drill 0.7 pad 1.3)
  Top 0.508: v24.25,41.75 v24.25,36.31 | v37.75,48 v33.75,48
  Bottom 0.508: 24.39,43.75 T5.E 24.37,41.87 v24.25,41.75 | T3.E 20.55,21.8 R5.1 15.25,25.75 13.75,27.25 13.75,30.75 15.5,32.5 17.25,32.5 21.06,36.31 v24.25,36.31 27.56,36.31 29.25,38 34.75,38 38,41.25 38,47.75 v37.75,48 | v33.75,48 33.25,48 32.25,49 32.25,52.25 31.25,53.25 31.25,57.5 29.5,59.25 29.5,73 31.42,74.92 R7.1 32.67,76.75 34.54,78.62 42.28,78.62 IC1(CORE).2 43.87,78.37 44.75,79.25 44.75,81.75 41.5,85 37,85 35.5,83.5 30.5,83.5 29.58,84.42 T1.E 29.58,88.27 R11.1
SCK  (via drill 0.6)
  Top 0.508: v27,111 v17.25,111
  Bottom 0.508: U$6.1$P 41,98 35.5,103.5 26,103.5 25.25,104.25 25.25,110.25 26,111 v27,111 | JP1.3 16.27,111.98 v17.25,111
SCK$CORE  (via drill 0.6)
  Top 0.508: v55,58.09 v55,89.75
  Bottom 0.508: IC1(CORE).19 54.96,58.05 v55,58.09 | v55,89.75 53.25,91.5 48.75,91.5 47.25,93 U$6.1$O
SCK$DISPLAY  (via drill 0.7 pad 1.3)
  Top 0.508: v53.25,112.5 v53.25,117
  Bottom 0.508: 32.29,113.96 JP4.4 | JP4.4 29.75,113.96 | v53.25,112.5 53.25,109.5 51.25,107.5 49.16,107.5 47.25,105.59 | IC1(DISPLAY).19 51.93,119.82 53.25,118.5 v53.25,117 | 47.25,105.59 U$6.1$S 47.75,100.5 | JP4.4 29.21,113.96 28.5,113.25 28.5,110.5 31.5,107.5 37.07,107.5 38.98,105.59 47.25,105.59
SCL
  Bottom 0.508: IC1(CORE).28 50.06,81 48.75,81 48,80.25 48,45.5 45.5,43 45.5,35 42,31.5 42,17.25 40.25,15.5 36.5,15.5 35.75,14.75 35.75,8.75 36.91,7.58 IC1.6 40.41,7.58 41,7 41,5.75 40.25,5 35.25,5 33.25,7 33.25,15 32.75,15.5 27.25,15.5 26.14,14.39 U$1.3
SDA
  Bottom 0.508: U$1.4 23.6,14.35 25.89,16.64 34.5,16.64 | IC1(CORE).27 51.87,78.37 52.75,79.25 52.75,81.5 51.75,82.5 48,82.5 47,81.5 47,46 44.5,43.5 44.5,35.75 41,32.25 41,18 39.64,16.64 34.5,16.64 | 34.5,16.64 34.5,7.75 35.94,6.32 IC1.5
TX  (via drill 0.7 pad 1.3)
  Top 0.508: v32.5,43.5 v32.5,36.5 | v37.75,50.25 v33.75,50.25
  Bottom 0.508: T6.C 23.08,53.92 22.25,54.75 22.25,57.25 23,58 26.25,58 27.75,56.5 27.75,51.5 28.75,50.5 28.75,46.75 30.5,45 31.5,45 32.48,44.02 32.48,43.52 v32.5,43.5 | T4.C 22.95,25.45 22,24.5 20,24.5 17.25,27.25 16.25,27.25 15,28.5 15,30.5 15.75,31.25 17.5,31.25 21,34.75 25.75,34.75 26.12,35.12 28.12,35.12 29.5,36.5 v32.5,36.5 34.75,36.5 39.25,41 39.25,49.5 38.5,50.25 v37.75,50.25 | v33.75,50.25 33.75,52.25 32.25,53.75 32.25,58 30.5,59.75 30.5,72.25 35.58,77.33 39.78,77.33 41.28,75.83 IC1(CORE).3 44.08,75.83 45.75,77.5 45.75,86.75 44.5,88 35.93,88 32.23,91.7 T2.C
USB$CTRL
  Bottom 0.508: R13.1 R14.1 30.33,33.5 33.5,33.5 40.25,40.25 40.25,52.25 40.97,52.97 IC1(CORE).12
USB$RX  (via drill 0.7 pad 1.3)
  Top 0.508: v16.75,60 v16.75,70.25
  Bottom 0.508: T6.E 19.63,51.38 19.39,51.14 U$2.3 21.25,53.1 21.25,57 20,58.25 R12.1 16.83,59.92 v16.75,60 | Q4.C 21.77,73.96 19.81,72 18.5,72 v16.75,70.25
USB$STATE
  Bottom 0.508: IC1(CORE).4 41.21,73.29 38.5,76 35.75,76 31.58,71.83 31.58,64.25 R29.1
USB$TX  (via drill 0.7 pad 1.3)
  Top 0.508: v13.5,60 v13.5,71.25
  Bottom 0.508: T5.C 24.31,46.25 21.75,46.25 19.4,48.6 U$2.4 17.5,50.39 17.5,56.25 13.75,60 v13.5,60 | Q5.E 15.96,73.71 v13.5,71.25

### Text on the board
Bottom: GND / VCC / DATA / / / / CLCK / CTRL | DRAGBERRY | GND / VCC / RESET / SCK / MISO / MOSI | LEDECORATOR | DISPLAY